# EAGLE design mainboard (EAGLE 9.6.2)
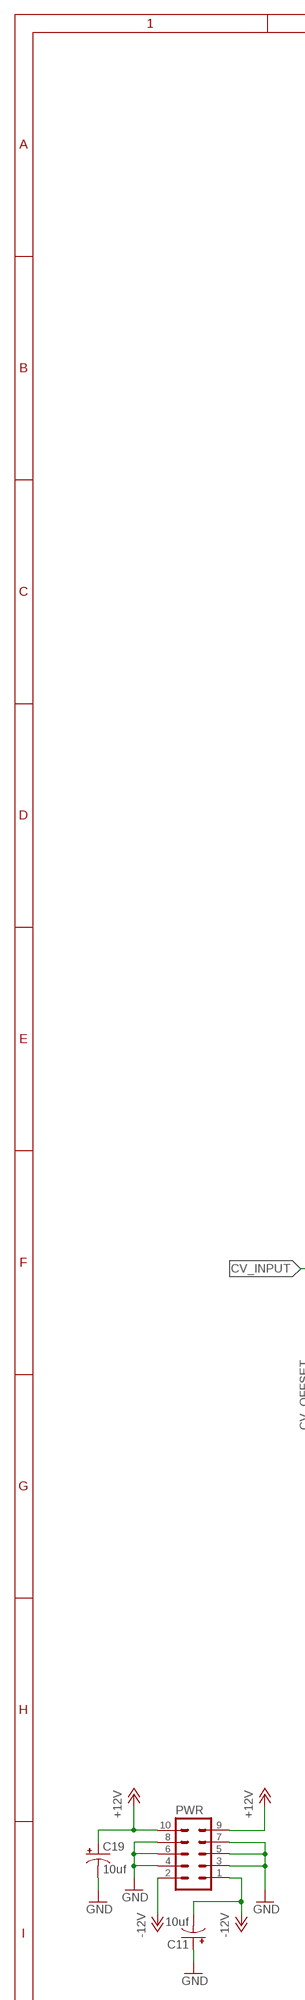
[diagram p0: schematic, sheet 1, part 1 of 2]
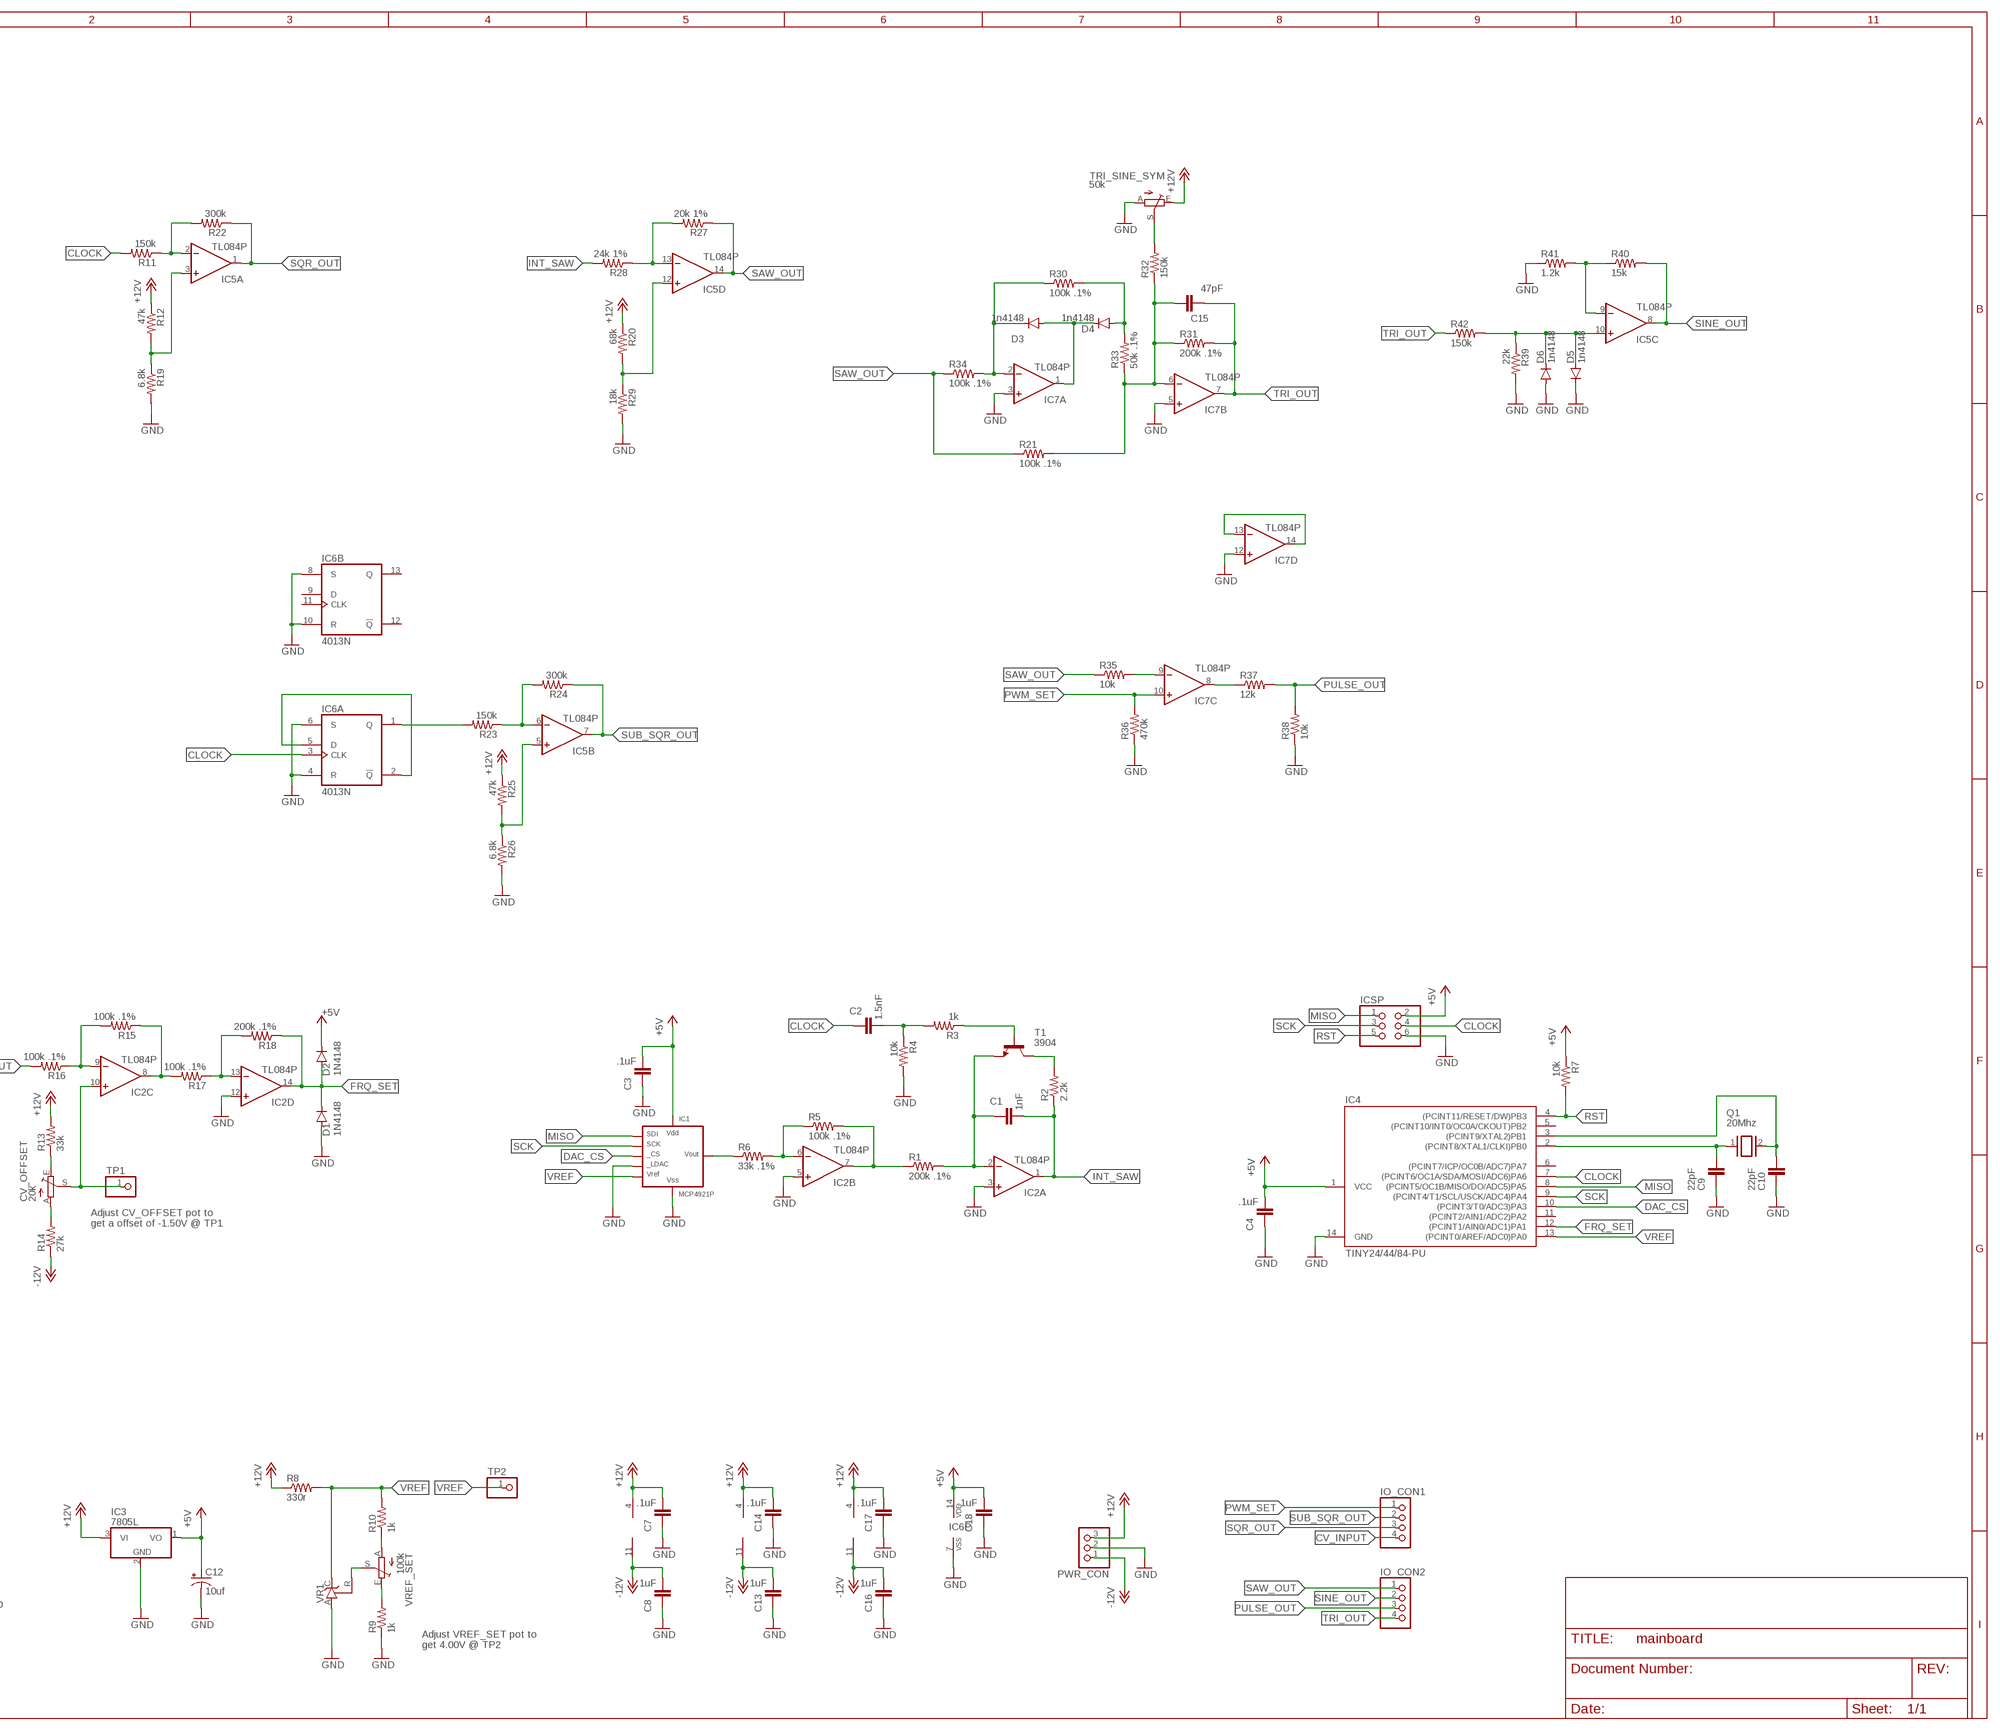
[diagram p1: schematic, sheet 1, part 2 of 2]

## Parts
C1  1nF  C-EU050-025X075  [C050-025X075]
C2  1.5nF  C-EU050-024X044  [C050-024X044]
C3  .1uF  C-EU050-024X044  [C050-024X044]
C4  .1uF  C-EU050-024X044  [C050-024X044]
C7  .1uF  C-EU050-024X044  [C050-024X044]
C8  .1uF  C-EU050-024X044  [C050-024X044]
C9  22pF  C-EU050-024X044  [C050-024X044]
C10  22pF  C-EU050-024X044  [C050-024X044]
C11  10uf  CPOL-USE2.5-5  [E2,5-5]
C12  10uf  CPOL-USE2.5-5  [E2,5-5]
C13  .1uF  C-EU050-024X044  [C050-024X044]
C14  .1uF  C-EU050-024X044  [C050-024X044]
C15  47pF  C-EU050-024X044  [C050-024X044]
C16  .1uF  C-EU050-024X044  [C050-024X044]
C17  .1uF  C-EU050-024X044  [C050-024X044]
C18  .1uF  C-EU050-024X044  [C050-024X044]
C19  10uf  CPOL-USE2.5-5  [E2,5-5]
CV_OFFSET  20k  TRIM_1234-S64YW  [S64YW]
D1  1N4148  1N4148DO35-7  [DO35-7]
D2  1N4148  1N4148DO35-7  [DO35-7]
D3  1n4148  1N4148DO35-7  [DO35-7]
D4  1n4148  1N4148DO35-7  [DO35-7]
D5  1n4148  1N4148DO35-7  [DO35-7]
D6  1n4148  1N4148DO35-7  [DO35-7]
IC1  MCP4921P  [DIL8]
IC2  TL084P  [DIL14]
IC3  7805L  [TO92]
IC4  TINY24/44/84-PU  [DIL14]
IC5  TL084P  [DIL14]
IC6  4013N  [DIL14]
IC7  TL084P  [DIL14]
ICSP  PINHD-2X3  [2X03]
IO_CON1  PINHD-1X4  [1X04]
IO_CON2  PINHD-1X4  [1X04]
PWR  ML10  [ML10]
PWR_CON  PINHD-1X3  [1X03]
Q1  20Mhz  XTAL/S  [QS]
R1  200k .1%  R-US_0207/7  [0207/7]
R2  2.2k  R-US_0207/7  [0207/7]
R3  1k  R-US_0207/7  [0207/7]
R4  10k  R-US_0207/7  [0207/7]
R5  100k .1%  R-US_0207/7  [0207/7]
R6  33k .1%  R-US_0207/7  [0207/7]
R7  10k  R-US_0207/7  [0207/7]
R8  330r  R-US_0207/7  [0207/7]
R9  1k  R-US_0207/7  [0207/7]
R10  1k  R-US_0207/7  [0207/7]
R11  150k  R-US_0207/7  [0207/7]
R12  47k  R-US_0207/7  [0207/7]
R13  33k  R-US_0207/7  [0207/7]
R14  27k  R-US_0207/7  [0207/7]
R15  100k .1%  R-US_0207/7  [0207/7]
R16  100k .1%  R-US_0207/7  [0207/7]
R17  100k .1%  R-US_0207/7  [0207/7]
R18  200k .1%  R-US_0207/7  [0207/7]
R19  6.8k  R-US_0207/7  [0207/7]
R20  68k  R-US_0207/7  [0207/7]
R21  100k .1%  R-US_0207/7  [0207/7]
R22  300k  R-US_0207/7  [0207/7]
R23  150k  R-US_0207/7  [0207/7]
R24  300k  R-US_0207/7  [0207/7]
R25  47k  R-US_0207/7  [0207/7]
R26  6.8k  R-US_0207/7  [0207/7]
R27  20k 1%  R-US_0207/7  [0207/7]
R28  24k 1%  R-US_0207/7  [0207/7]
R29  18k  R-US_0207/7  [0207/7]
R30  100k .1%  R-US_0207/7  [0207/7]
R31  200k .1%  R-US_0207/7  [0207/7]
R32  150k  R-US_0207/7  [0207/7]
R33  50k .1%  R-US_0207/7  [0207/7]
R34  100k .1%  R-US_0207/7  [0207/7]
R35  10k  R-US_0207/7  [0207/7]
R36  470k  R-US_0207/7  [0207/7]
R37  12k  R-US_0207/7  [0207/7]
R38  10k  R-US_0207/7  [0207/7]
R39  22k  R-US_0207/7  [0207/7]
R40  15k  R-US_0207/7  [0207/7]
R41  1.2k  R-US_0207/7  [0207/7]
R42  150k  R-US_0207/7  [0207/7]
T1  3904  2N3904-NPN-TO92-EBC  [TO92-EBC]
TP1  PINHD-1X1  [1X01]
TP2  PINHD-1X1  [1X01]
TRI_SINE_SYM  50k  TRIM_1234-S64YW  [S64YW]
VR1  TL431CLP  [TO92-CLP]
VREF_SET  100k  TRIM_1234-S64YW  [S64YW]

## Nets
+5V: C3.2 C4.2 C12.+ C18.2 D2.C IC1.1(VDD) IC3.1(VO) IC4.1(VCC) IC6.14(P:VDD) ICSP.2 R7.1
+12V: C7.2 C14.2 C17.2 C19.+ IC2.4(P:V+) IC3.3(VI) IC5.4(P:V+) IC7.4(P:V+) PWR.9 PWR.10 PWR_CON.3 R8.1 R12.1 R13.2 R20.1 R25.1 TRI_SINE_SYM.E
-12V: C8.2 C11.- C13.2 C16.2 IC2.11(P:V-) IC5.11(P:V-) IC7.11(P:V-) PWR.1 PWR.2 PWR_CON.1 R14.1
CLOCK: C2.1 IC4.7((PCINT6/OC1A/SDA/MOSI/ADC6)PA6) IC6.3(A:CLK) ICSP.4 R11.2
CV_INPUT: IO_CON1.4 R16.2
DAC_CS: IC1.2(CS) IC4.10((PCINT3/T0/ADC3)PA3)
FRQ_SET: D1.C D2.A IC2.14(D:OUT) IC4.12((PCINT1/AIN0/ADC1)PA1) R18.1
GND: C3.1 C4.1 C7.1 C8.1 C9.1 C10.1 C11.+ C12.- C13.1 C14.1 C16.1 C17.1 C18.1 C19.- D1.A D5.C D6.A IC1.5(LDAC) IC1.7(VSS) IC2.3(A:+IN) IC2.5(B:+IN) IC2.12(D:+IN) IC3.2(GND) IC4.14(GND) IC6.4(A:R) IC6.6(A:S) IC6.7(P:VSS) IC6.8(B:S) IC6.10(B:R) IC7.3(A:+IN) IC7.5(B:+IN) IC7.12(D:+IN) ICSP.6 PWR.3 PWR.4 PWR.5 PWR.6 PWR.7 PWR.8 PWR_CON.2 R4.2 R9.1 R19.2 R26.2 R29.2 R36.1 R38.1 R39.2 R41.1 TRI_SINE_SYM.A VR1.A
INT_SAW: C1.2 IC2.1(A:OUT) R2.1 R28.2
MISO: IC1.4(SDI) IC4.8((PCINT5/OC1B/MISO/DO/ADC5)PA5) ICSP.1
N$1: C1.1 IC2.2(A:-IN) R1.2 T1.E
N$2: R2.2 T1.C
N$3: R3.1 T1.B
N$4: R9.2 VREF_SET.E
N$5: C2.2 R3.2 R4.1
N$6: IC2.7(B:OUT) R1.1 R5.2
N$7: C9.2 IC4.2((PCINT8/XTAL1/CLKI)PB0) Q1.1
N$8: IC2.6(B:-IN) R5.1 R6.2
N$9: IC1.8(VOUT) R6.1
N$10: IC6.1(A:Q) R23.2
N$11: C10.2 IC4.3((PCINT9/XTAL2)PB1) Q1.2
N$12: R10.1 VREF_SET.A
N$13: VR1.R VREF_SET.S
N$14: CV_OFFSET.A R14.2
N$15: CV_OFFSET.E R13.1
N$16: CV_OFFSET.S IC2.10(C:+IN) TP1.1
N$17: IC2.9(C:-IN) R15.2 R16.1
N$18: IC6.2(A:!Q) IC6.5(A:D)
N$19: IC2.8(C:OUT) R15.1 R17.2
N$20: IC2.13(D:-IN) R17.1 R18.2
N$21: IC5.6(B:-IN) R23.1 R24.2
N$22: IC5.2(A:-IN) R11.1 R22.2
N$23: IC5.3(A:+IN) R12.2 R19.1
N$24: IC5.5(B:+IN) R25.2 R26.1
N$25: IC5.12(D:+IN) R20.2 R29.1
N$26: IC5.13(D:-IN) R27.2 R28.1
N$27: C15.2 IC7.6(B:-IN) R21.2 R31.1 R32.1 R33.1
N$28: D3.C IC7.2(A:-IN) R30.1 R34.2
N$29: D3.A D4.C IC7.1(A:OUT)
N$30: D4.A R30.2 R33.2
N$31: IC7.8(C:OUT) R37.1
N$32: IC7.9(C:-IN) R35.2
N$33: D5.A D6.C IC5.10(C:+IN) R39.1 R42.2
N$34: R32.2 TRI_SINE_SYM.S
N$35: IC7.13(D:-IN) IC7.14(D:OUT)
N$36: IC5.9(C:-IN) R40.1 R41.2
PULSE_OUT: IO_CON2.3 R37.2 R38.2
PWM_SET: IC7.10(C:+IN) IO_CON1.1 R36.2
RST: IC4.4((PCINT11/RESET/DW)PB3) ICSP.5 R7.2
SAW_OUT: IC5.14(D:OUT) IO_CON2.1 R21.1 R27.1 R34.1 R35.1
SCK: IC1.3(SCK) IC4.9((PCINT4/T1/SCL/USCK/ADC4)PA4) ICSP.3
SINE_OUT: IC5.8(C:OUT) IO_CON2.2 R40.2
SQR_OUT: IC5.1(A:OUT) IO_CON1.3 R22.1
SUB_SQR_OUT: IC5.7(B:OUT) IO_CON1.2 R24.1
TRI_OUT: C15.1 IC7.7(B:OUT) IO_CON2.4 R31.2 R42.1
VREF: IC1.6(VREF) IC4.13((PCINT0/AREF/ADC0)PA0) R8.2 R10.2 TP2.1 VR1.C
Unconnected: CV_OFFSET.S@1(S) IC4.5((PCINT10/INT0/OC0A/CKOUT)PB2) IC4.6((PCINT7/ICP/OC0B/ADC7)PA7) IC4.11((PCINT2/AIN1/ADC2)PA2) IC6.9(B:D) IC6.11(B:CLK) IC6.12(B:!Q) IC6.13(B:Q) TRI_SINE_SYM.S@1(S) VREF_SET.S@1(S)

## Notes on the sheet
- Adjust CV_OFFSET pot to 
  get a offset of -1.50V @ TP1
- Adjust VREF_SET pot to 
  get 4.00V @ TP2

## Library data of the parts
C1-C4 C7-C10 C13-C18 = rcl:C-EU: CAPACITOR, European symbol; SPICEPREFIX: C
C11 C12 C19 = resistor:CPOL-US: POLARIZED CAPACITOR, American symbol
CV_OFFSET TRI_SINE_SYM VREF_SET = pot:TRIM_1234-: POTENTIOMETER
D1-D6 = diode:1N4148: DIODE high speed (Philips)
IC1 = microchip-dac:MCP4921: MCP4921: 12-bit DAC MCP4901/4911/4921 - 8/10/12-Bit Voltage Output Digital-to-Analog Converter with SPI Interface Interface The MCP49x1 devices are single channel 8-bit, 10-bit and 12-bit buffered voltage output Digital-to-Analog Converters (DACs), respectively. The devices operate from a single 2.7V to 5.5V supply with an SPI compatible Serial Peripheral Interface. The user can configure the full-scale range of the device to be VREF or 2*VREF by setting the Gain Selection Option bit (gain of 1 of 2). RobG
IC2 IC5 IC7 = linear:TL084: OP AMP
IC3 = linear:78*: Positive VOLTAGE REGULATOR Source: http://cache.national.com/ds/LM/LM78L05.pdf http://www.fairchildsemi.com/ds/LM/LM7805.pdf
IC4 = avr-7:TINY24/44/84
IC6 = 40xx:4013: Dual D FLIP FLOP, set/reset
ICSP = pinhead:PINHD-2X3: PIN HEADER
IO_CON1 IO_CON2 = pinhead:PINHD-1X4: PIN HEADER
PWR = con-ml:ML10: HARTING; OC_FARNELL: unknown; OC_NEWARK: unknown
PWR_CON = pinhead:PINHD-1X3: PIN HEADER
Q1 = special:XTAL/S: CRYSTAL
R1-R42 = rcl:R-US_: RESISTOR, American symbol; SPICEPREFIX: R
T1 = transistor-neu-to92:*-NPN-: NPN Transistror
TP1 TP2 = pinhead:PINHD-1X1: PIN HEADER
VR1 = v-reg:TL431CLP: VOLTAGE REGULATOR

## Board
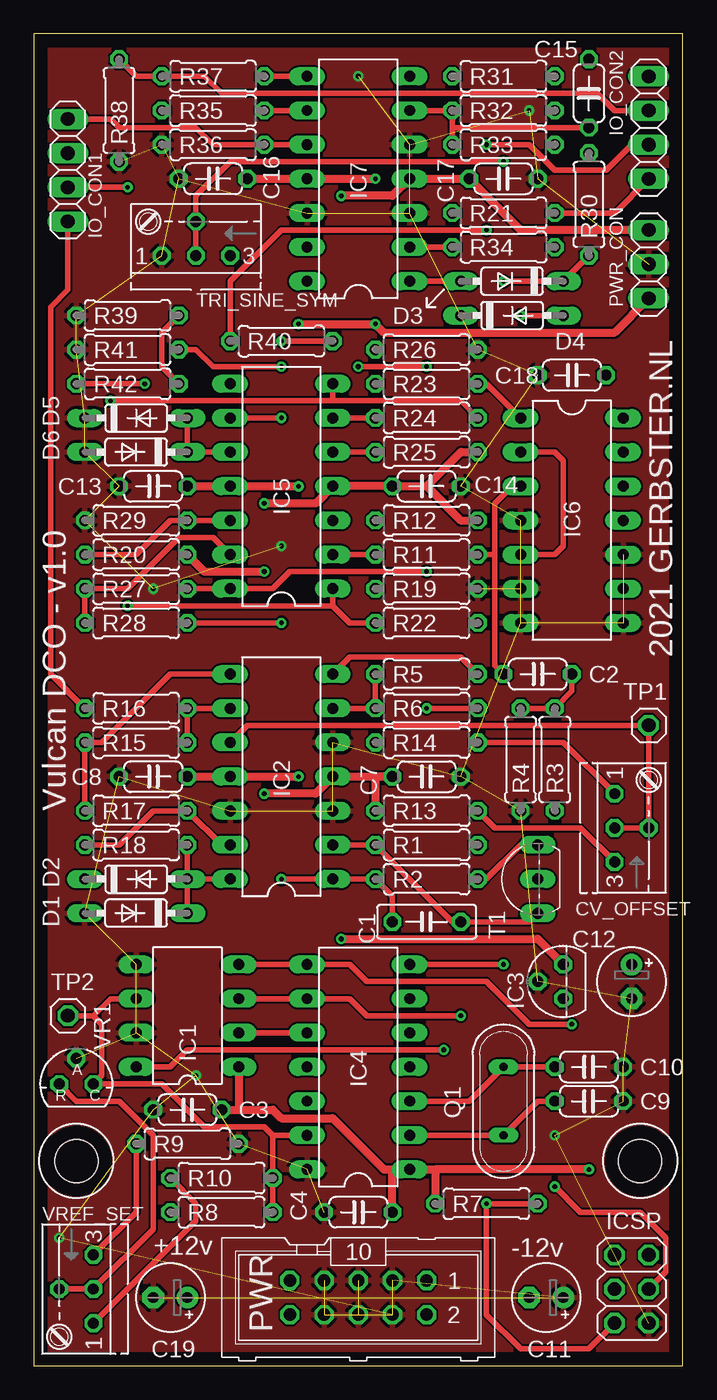
[diagram p2: board, top side]
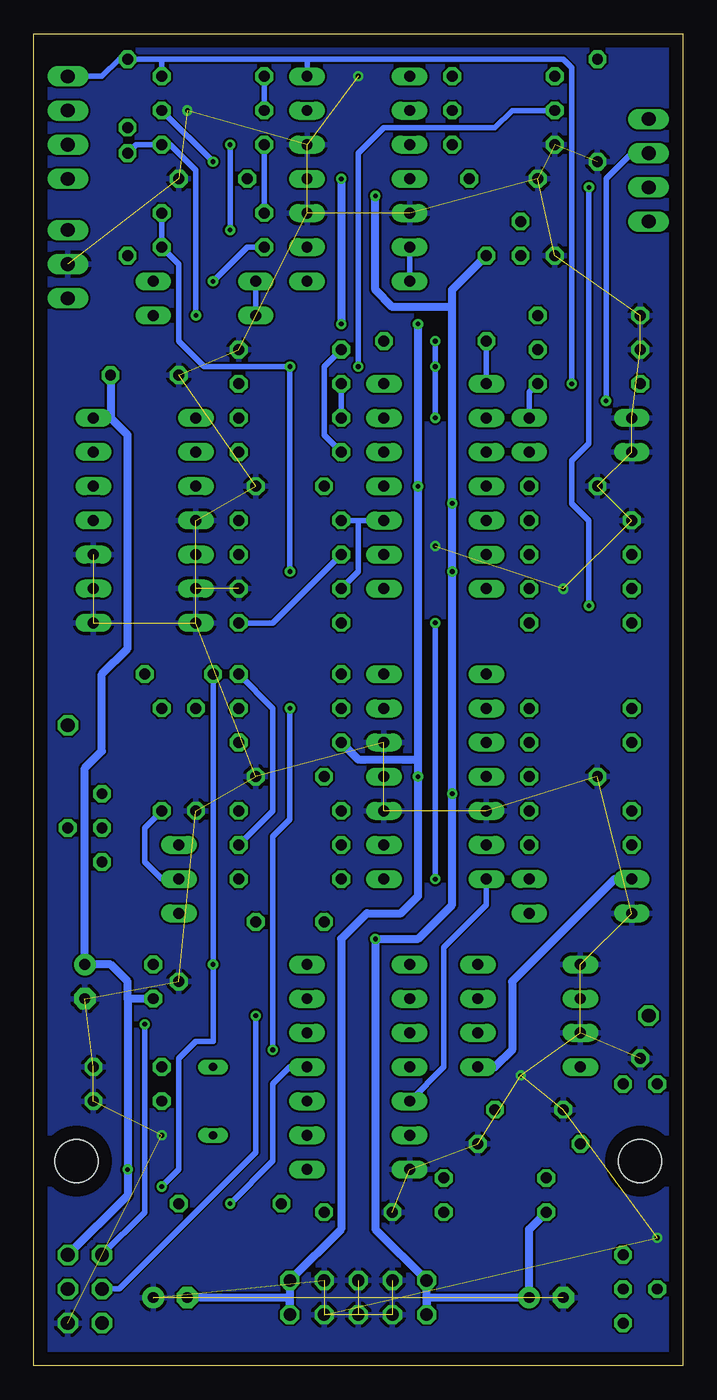
[diagram p3: board, bottom side, seen from below]

Size 48.26 x 99.06 mm. Coordinates in mm from the lower left corner, seen from the top.
Outline: 0,0 48.26,0 48.26,99.06 0,99.05 0,0
Copper layers (1*16): Top 0.035mm / dielectric 1.5mm / Bottom 0.035mm
Design rules "default": minimum track width 6mil, minimum drill 0.35mm, track to track 6mil, track to pad 6mil, pad to pad 6mil, via to via 6mil, smd to smd 6mil, copper to edge 40mil, drill to drill 6mil, minimum pad ring 10mil, minimum via ring 8mil, stop-mask expansion 4mil, vias tented up to drill 0mil, thermal gap 10mil
Holes 3.2 mm at 45.09,15.24 3.17,15.24

### Footprints (pad centres in the part's own frame; a part is rotated, then mirrored left to right if it is on the bottom)
C050-025X075 = drill 0.813 octagon: 1 -2.54,0; 2 2.54,0
C050-024X044 = drill 0.813 octagon: 1 -2.54,0; 2 2.54,0
E2,5-5 = drill 0.813 pad 1.6: + -1.27,0 | drill 0.813 pad 1.6 octagon: - 1.27,0
S64YW = drill 0.813 octagon: A 2.54,1.27; E -2.54,1.27; S 0,-1.27; S@1 0,1.27
DO35-7 = drill 0.813 long: A 3.81,0; C -3.81,0
DIL8 = drill 0.813 long: 1 -3.81,-3.81; 2 -1.27,-3.81; 3 1.27,-3.81; 4 3.81,-3.81; 5 3.81,3.81; 6 1.27,3.81; 7 -1.27,3.81; 8 -3.81,3.81
DIL14 = drill 0.813 long: 1 -7.62,-3.81; 2 -5.08,-3.81; 3 -2.54,-3.81; 4 0,-3.81; 5 2.54,-3.81; 6 5.08,-3.81; 7 7.62,-3.81; 8 7.62,3.81; 9 5.08,3.81; 10 2.54,3.81; 11 0,3.81; 12 -2.54,3.81; 13 -5.08,3.81; 14 -7.62,3.81
TO92 = drill 0.813 octagon: 1 -1.27,0; 2 0,1.905; 3 1.27,0
2X03 = drill 1.016 octagon: 1 -2.54,-1.27; 2 -2.54,1.27; 3 0,-1.27; 4 0,1.27; 5 2.54,-1.27; 6 2.54,1.27
1X04 = drill 1.016 long: 1 -3.81,0; 2 -1.27,0; 3 1.27,0; 4 3.81,0
ML10 = drill 0.914 octagon: 1 -5.08,-1.27; 2 -5.08,1.27; 3 -2.54,-1.27; 4 -2.54,1.27; 5 0,-1.27; 6 0,1.27; 7 2.54,-1.27; 8 2.54,1.27; 9 5.08,-1.27; 10 5.08,1.27
1X03 = drill 1.016 long: 1 -2.54,0; 2 0,0; 3 2.54,0
QS = drill 0.61 long: 1 -2.54,0; 2 2.54,0
0207/7 = drill 0.813 octagon: 1 -3.81,0; 2 3.81,0
TO92-EBC = drill 0.813 long: B 0,-1.27; C 2.54,-1.27; E -2.54,-1.27
1X01 = drill 1.016 octagon: 1 0,0
TO92-CLP = drill 0.813 octagon: A 0,1.905; C 1.27,0; R -1.27,0

### Placement (x,y rotation side)
C1  29.21,33.02 180 top
C2  37.47,51.44 0 top
C3  11.43,19.05 0 top
C4  24.13,11.43 0 top
C7  29.21,43.81 180 top
C8  8.89,43.81 0 top
C9  41.27,19.68 180 top
C10  41.27,22.23 180 top
C11  38.1,5.08 180 top
C12  44.45,28.57 270 top
C13  8.89,65.41 0 top
C14  29.21,65.41 180 top
C15  41.27,94.61 270 top
C16  13.34,88.27 0 top
C17  34.92,88.27 180 top
C18  40.01,73.66 0 top
C19  10.16,5.08 180 top
CV_OFFSET  44.45,40.01 90 top
D1  7.62,33.66 180 top
D2  7.62,36.2 0 top
D3  35.56,80.64 180 top
D4  35.56,78.11 0 top
D5  7.62,70.48 0 top
D6  7.62,67.94 180 top
IC1  11.43,26.04 90 top
IC2  18.41,43.81 90 top
IC3  39.37,28.57 90 top
IC4  24.13,22.23 90 top
IC5  18.41,65.41 90 top
IC6  40.01,62.87 270 top
IC7  24.13,88.27 90 top
ICSP  44.45,5.71 270 top
IO_CON1  2.54,88.9 270 top
IO_CON2  45.72,92.08 90 top
PWR  24.13,5.08 180 top
PWR_CON  45.72,81.92 90 top
Q1  34.92,19.68 90 top
R1  29.21,38.73 180 top
R2  29.21,36.2 0 top
R3  38.73,45.09 90 top
R4  36.2,45.09 270 top
R5  29.21,51.44 0 top
R6  29.21,48.9 180 top
R7  33.66,12.06 0 top
R8  13.97,11.43 0 top
R9  11.43,16.51 180 top
R10  13.97,13.97 0 top
R11  29.21,60.33 0 top
R12  29.21,62.87 180 top
R13  29.21,41.27 180 top
R14  29.21,46.35 0 top
R15  7.62,46.35 0 top
R16  7.62,48.9 180 top
R17  7.62,41.27 180 top
R18  7.62,38.73 180 top
R19  29.21,57.78 0 top
R20  7.62,60.33 180 top
R21  34.92,85.72 180 top
R22  29.21,55.24 0 top
R23  29.21,73.03 0 top
R24  29.21,70.48 180 top
R25  29.21,67.94 180 top
R26  29.21,75.56 0 top
R27  7.62,57.78 180 top
R28  7.62,55.24 0 top
R29  7.62,62.87 180 top
R30  41.27,86.36 90 top
R31  34.92,95.89 0 top
R32  34.92,93.34 0 top
R33  34.92,90.81 0 top
R34  34.92,83.19 180 top
R35  13.34,93.34 0 top
R36  13.34,90.81 0 top
R37  13.34,95.89 180 top
R38  6.35,93.34 90 top
R39  6.99,78.11 180 top
R40  18.41,76.2 180 top
R41  6.99,75.56 0 top
R42  6.99,73.03 0 top
T1  36.2,36.2 90 top
TP1  45.72,47.62 0 top
TP2  2.54,26.04 0 top
TRI_SINE_SYM  12.06,83.82 180 top
VR1  3.17,20.95 0 top
VREF_SET  3.17,5.71 270 top

### Tracks (layer width: path | path; a pad name or v marks a point on that pad's centre or on a via)
+5V  (via drill 0.35)
  Top 0.61: C3.2 15.24,19.05 | 15.24,19.05 17.78,19.05 18.41,18.41 22.23,18.41 26.04,14.61 26.67,14.61 | 26.67,14.61 IC4.1 29.84,14.61 | 29.84,14.61 R7.1 | C4.2 26.67,14.61 | v41.27,14.61 29.84,14.61 | IC1.1 15.24,19.05
  Bottom 0.61: D2.C 5.08,36.2 12.7,28.57 12.7,23.5 13.97,22.23 IC1.1 | IC3.1 41.27,27.3 | 41.27,27.3 41.27,28.57 42.55,29.84 C12.+ 44.45,44.45 43.18,45.72 43.18,51.44 41.27,53.34 41.27,69.22 42.55,70.48 | 41.27,27.3 v41.27,14.61 41.27,12.7 ICSP.2 | C18.2 42.55,70.48 | 42.55,70.48 IC6.14
+12V  (via drill 0.35)
  Top 0.61: v17.14,64.14 20.95,64.14 IC5.4 C14.2 29.21,65.41 | 29.21,65.41 31.75,67.94 R25.1 | 29.21,65.41 31.75,62.87 R12.1 | R20.1 12.7,59.05 v17.14,59.05 | v17.14,42.55 20.95,42.55 IC2.4 C7.2 25.4,43.81 R13.2 | v22.86,87 26.67,87 IC7.4 C17.2 36.2,84.45 PWR_CON.3 | v22.86,31.75 37.47,31.75 IC3.3
  Bottom 0.61: 17.14,78.74 21.59,78.74 22.86,80.01 v22.86,87 | 17.14,78.74 v17.14,64.14 v17.14,59.05 v17.14,42.55 17.14,34.29 19.68,31.75 v22.86,31.75 22.86,10.16 PWR.9 PWR.10 19.05,5.08 C19.+ 11.43,10.16 R8.1 | 17.14,78.74 17.14,80.01 TRI_SINE_SYM.E
-12V  (via drill 0.35)
  Top 0.61: v19.68,77.47 v25.4,77.47 26.04,76.83 43.18,76.83 PWR_CON.1 | C13.2 IC5.11 v19.68,65.41 | C8.2 IC2.11 v19.68,43.81 | C16.2 IC7.11 v25.4,88.27
  Bottom 0.61: v25.4,88.27 v25.4,77.47 | 19.68,45.09 v19.68,43.81 19.68,34.92 20.95,33.66 23.5,33.66 25.4,31.75 25.4,10.16 PWR.1 PWR.2 29.21,5.08 C11.- | 19.68,45.09 v19.68,65.41 v19.68,77.47 | R14.1 24.13,45.09 19.68,45.09
CLOCK  (via drill 0.35)
  Top 0.406: IC6.3 35.56,65.41 34.29,64.14 34.29,60.33 | 34.29,60.33 R11.2 | 34.29,60.33 34.29,52.07 C2.1 | v34.92,29.84 IC4.7 | v38.73,13.34 40.64,11.43 45.09,11.43 46.99,9.53 46.99,6.99 ICSP.4
  Bottom 0.406: C2.1 v34.92,29.84 34.92,24.13 36.2,24.13 37.47,22.86 37.47,14.61 v38.73,13.34
CV_INPUT
  Top 0.406: IO_CON1.4 2.54,80.01 1.27,78.74 1.27,51.44 R16.2
DAC_CS
  Top 0.406: IC4.10 IC1.2
FRQ_SET
  Top 0.406: IC2.14 D2.A | R18.1 D2.A | D2.A D1.C
  Bottom 0.406: IC4.12 17.78,22.23 17.78,31.11 14.61,34.29 IC2.14
GND  (via drill 0.35)  (57 unrouted)
  other vias: 18.41,60.96 8.89,57.78 24.13,95.89 36.83,93.34 1.91,9.53 12.06,21.59 38.73,17.14
  pour Top: 0,0 48.26,0 48.26,99.06 0,99.06
  pour Bottom: 0,0 48.26,0 48.26,99.06 0,99.06
INT_SAW  (via drill 0.35)
  Top 0.406: C1.2 26.67,34.92 R2.1 IC2.1 v18.41,36.2 | v18.41,55.24 R28.2
  Bottom 0.406: v18.41,36.2 v18.41,55.24
MISO  (via drill 0.35)
  Top 0.406: IC1.4 IC4.8 23.5,29.84 24.77,28.57 33.66,28.57 36.83,25.4 v40.01,25.4
  Bottom 0.406: v40.01,25.4 40.01,11.43 ICSP.1
N$1
  Top 0.406: IC2.2 R1.2 31.11,33.02 C1.1 36.83,33.02 T1.E
N$2
  Top 0.406: T1.C 36.2,38.73 33.66,36.2 R2.2
N$3
  Bottom 0.406: R3.1 40.01,40.01 40.01,37.47 38.73,36.2 T1.B
N$4
  Top 0.406: R9.2 7.62,11.43 VREF_SET.E
N$5
  Top 0.406: C2.2 40.01,50.16 R3.2 R4.1
N$6
  Top 0.406: IC2.7 23.5,52.7 31.75,52.7 R5.2
  Bottom 0.406: R1.1 30.48,41.27 30.48,48.9 R5.2
N$7
  Top 0.406: IC4.2 Q1.1 37.47,19.68 C9.2
N$8
  Top 0.406: IC2.6 R6.2 R5.1
N$9  (via drill 0.35)
  Top 0.406: IC1.8 10.16,22.23 11.43,23.5 v30.48,23.5 | v29.21,48.9 R6.1
  Bottom 0.406: v30.48,23.5 30.48,39.37 29.21,40.64 v29.21,48.9
N$10
  Top 0.406: R23.2 33.66,73.03 IC6.1
N$11
  Top 0.406: IC4.3 32.38,19.68 Q1.2 C10.2
N$12
  Top 0.406: R10.1 12.06,12.06 12.06,10.79 VREF_SET.A
N$13
  Top 0.406: VR1.R 3.17,19.68 6.35,19.68 8.89,17.14 8.89,10.16 4.45,5.71 VREF_SET.S
N$14
  Top 0.406: R14.2 39.37,46.35 CV_OFFSET.A
N$15
  Top 0.406: R13.1 34.29,40.01 40.64,40.01 CV_OFFSET.E
N$16
  Top 0.406: IC2.10 15.88,47.62 TP1.1 CV_OFFSET.S 43.18,40.01
N$17
  Top 0.406: IC2.9 R16.1 R15.2
N$18
  Top 0.406: IC6.2 38.73,67.94 39.37,67.31 39.37,60.96 38.73,60.33 IC6.5
N$19
  Top 0.406: R17.2 R15.1 5.08,46.35 10.16,51.44 IC2.8
N$20
  Top 0.406: IC2.13 13.97,38.73 R17.1 8.89,41.27 6.35,38.73 R18.2
N$21
  Top 0.406: IC5.6 R24.2
  Bottom 0.406: R23.1 R24.2
N$22
  Top 0.406: IC5.2 R11.1
  Bottom 0.406: R11.1 30.48,55.24 R22.2
N$23
  Bottom 0.406: IC5.3 R12.2 24.13,62.87 24.13,59.05 R19.1
N$24
  Top 0.406: IC5.5 R25.2
  Bottom 0.406: R26.1 26.67,74.3 26.67,69.22 R25.2
N$25
  Top 0.406: IC5.12 R29.1 10.16,62.87 7.62,60.33 R20.2
N$26
  Top 0.406: R28.1 R27.2 6.99,57.78 10.79,61.59 13.34,61.59 IC5.13
N$27
  Top 0.406: IC7.6 R32.1 31.11,92.08 | C15.2 31.11,92.08 | R33.1 31.11,92.08
  Bottom 0.406: R33.1 R21.2 | R31.1 R32.1
N$28  (via drill 0.35)
  Top 0.406: IC7.2 R34.2 | R30.1 D3.C v34.92,80.64
  Bottom 0.406: R34.2 32.38,83.19 v34.92,80.64
N$29
  Top 0.406: IC7.1 D3.A
  Bottom 0.406: D3.A D4.C
N$30  (via drill 0.35)
  Top 0.406: v36.2,78.11 D4.A
  Bottom 0.406: R30.2 40.64,90.81 R33.2 38.1,90.81 36.2,88.9 v36.2,78.11
N$31
  Top 0.406: IC7.8 R37.1
N$32
  Top 0.406: IC7.9 R35.2
N$33
  Top 0.406: IC5.10 D6.C D5.A | R42.2 9.53,74.3 9.53,76.83 R39.1
  Bottom 0.406: D5.A 11.43,72.39 R42.2
N$34  (via drill 0.35)
  Top 0.406: v34.92,89.53 14.61,89.53 12.06,87 TRI_SINE_SYM.S 12.06,82.55
  Bottom 0.406: R32.2 v34.92,89.53
N$35
  Bottom 0.406: IC7.13 IC7.14
N$36  (via drill 0.35)
  Top 0.406: IC5.9 v18.41,70.48 | v18.41,76.2 R40.1 | R41.2 12.06,75.56 13.34,74.3 v18.41,74.3
  Bottom 0.406: v18.41,70.48 v18.41,74.3 v18.41,76.2
PULSE_OUT
  Top 0.406: R38.2 7.62,95.89 R37.2 12.7,95.89 13.97,94.61 41.91,94.61 43.18,93.34 IO_CON2.3
PWM_SET
  Top 0.406: IC7.10 R36.2 13.34,90.81 12.06,92.08 6.35,92.08 5.71,92.71 IO_CON1.1
RST  (via drill 0.35)
  Top 0.406: ICSP.5 41.27,1.27 36.2,1.27 33.66,3.81 v33.66,12.06 R7.2
  Bottom 0.406: v33.66,12.06 30.48,15.24 30.48,20.95 29.21,22.23 IC4.4
SAW_OUT  (via drill 0.35)
  Top 0.406: R27.1 IC5.14 17.78,57.78 19.05,59.05 v29.21,59.05 | IO_CON2.1 43.18,85.72 R21.1 | v29.21,74.3 v24.13,74.3
  Bottom 0.406: R21.1 R34.1 37.47,81.92 37.47,76.2 35.56,74.3 v29.21,74.3 v29.21,59.05 | R35.1 12.7,93.34 13.97,92.08 22.23,92.08 24.13,90.17 v24.13,74.3
SCK  (via drill 0.35)
  Top 0.406: IC1.3 IC4.9 23.5,27.3 24.77,26.04 v31.75,26.04
  Bottom 0.406: v31.75,26.04 31.75,15.88 41.91,5.71 ICSP.3
SINE_OUT  (via drill 0.35)
  Top 0.406: R40.2 14.61,80.64 18.41,84.45 v33.66,84.45 | v33.66,90.81 36.83,90.81 38.73,88.9 42.55,88.9 44.45,90.81 IO_CON2.2
  Bottom 0.406: R40.2 IC5.8 | v33.66,84.45 v33.66,90.81
SQR_OUT  (via drill 0.35)
  Top 0.406: IC5.1 22.23,56.52 | 22.23,56.52 23.5,55.24 R22.1 | IO_CON1.3 v6.99,87.63 | v6.99,56.52 22.23,56.52
  Bottom 0.406: v6.99,87.63 6.99,68.58 8.26,67.31 8.26,64.14 6.99,62.87 v6.99,56.52
SUB_SQR_OUT  (via drill 0.35)
  Top 0.406: IC5.7 22.23,71.75 | 22.23,71.75 31.75,71.75 R24.1 | 22.23,71.75 v5.71,71.75
  Bottom 0.406: v5.71,71.75 5.71,88.27 3.81,90.17 IO_CON1.2
TRI_OUT  (via drill 0.35)
  Top 0.406: R42.1 v8.26,73.03
  Bottom 0.406: IC7.7 27.94,97.16 | 27.94,97.16 38.73,97.16 | R31.2 38.73,97.16 | 38.73,97.16 C15.1 41.91,97.16 43.18,95.89 IO_CON2.4 | v8.26,73.03 8.26,96.52 8.89,97.16 27.94,97.16
VREF
  Top 0.406: R8.2 R10.2 17.78,17.14 | IC4.13 17.78,17.14 | 4.45,26.04 5.08,25.4 5.08,21.59 VR1.C 9.53,20.95 12.7,17.78 17.14,17.78 17.78,17.14 | 4.45,26.04 5.71,27.3 IC1.6 | TP2.1 4.45,26.04

### Text on the board
tNames: 2021 GERBSTER.NL | Vulcan DCO - v1.0 | -12v | +12v